# Altium schematic sheet 8V54816A_SUPPLY.SchDoc: AMC FMC Carrier v4
size 420 x 297 mm; CompanyName: WUT; Organization: WUT ISE; Address1: Warsaw University of Technology; Address2: Nowowiejska 15/19 00-665 Warsaw; Address3: t.przywozki@gmail.com; Revision: 1; SheetNumber: 24; SheetTotal: 29; Project: AMC FMC Carrier v4.0.2; ModifiedBy: F. Świtakowski; CheckedDate: -; Title2: 8V54816A Supply; DivGrp: ISE; Designer: T. Przywozki; ModifiedDate: -; ProjectName: ADC/DAC MEZZANINE
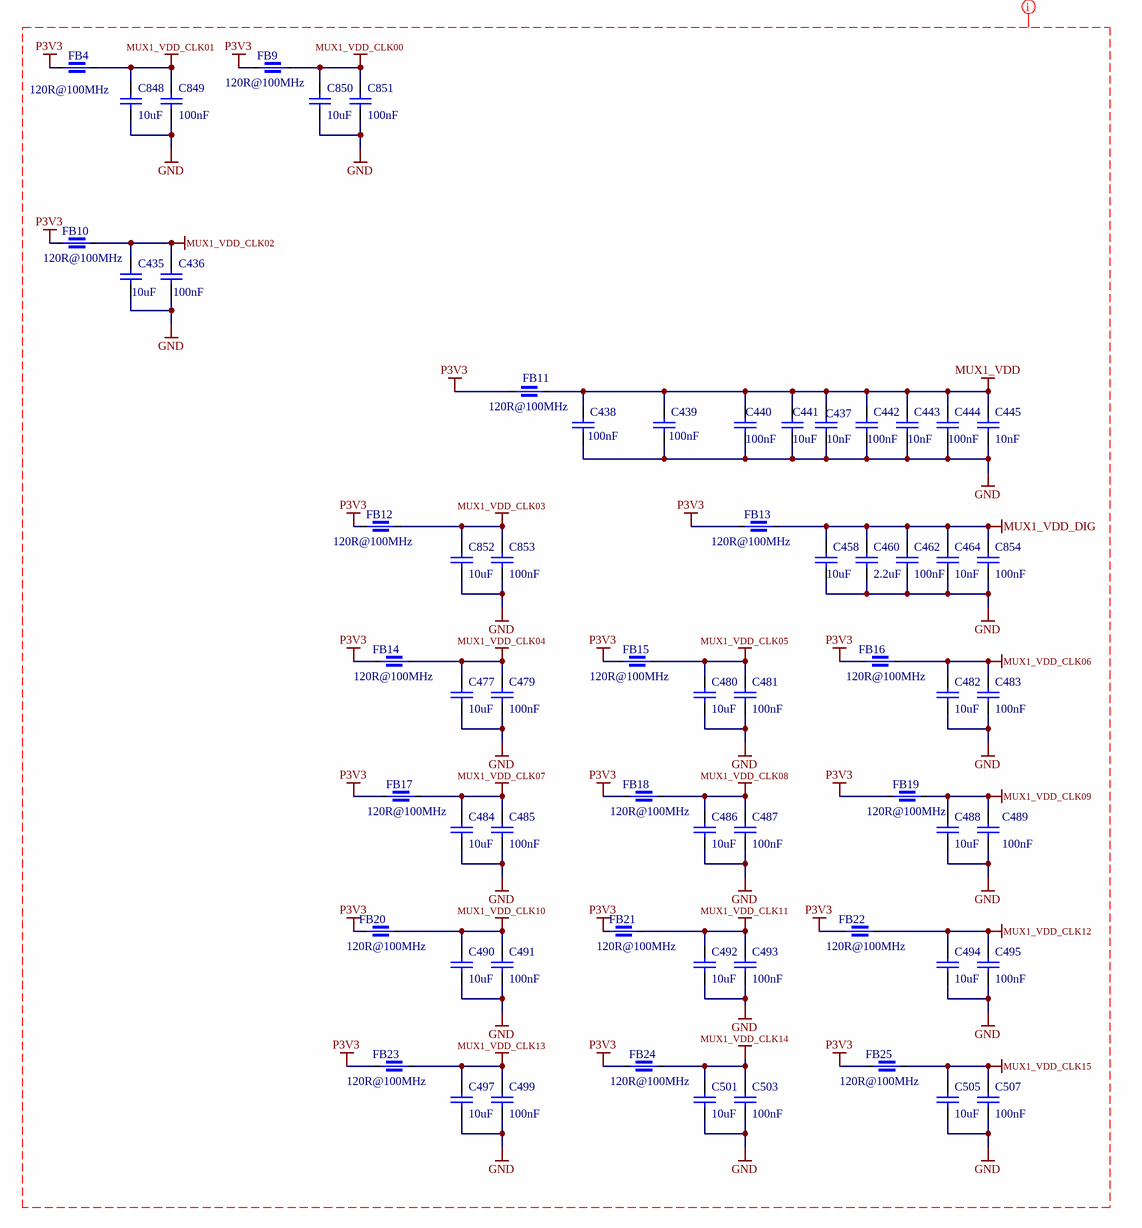
[diagram p0: 8V54816A_SUPPLY.SchDoc]

## Parts
C435  10uF  [CAPC1608X87N]
C436  100nF  [CAPC0603X33N]
C437  10nF  [CAPC0603X33N]
C438  100nF  [CAPC0603X33N]
C439  100nF  [CAPC0603X33N]
C440  100nF  [CAPC0603X33N]
C441  10uF  [CAPC1608X87N]
C442  100nF  [CAPC0603X33N]
C443  10nF  [CAPC0603X33N]
C444  100nF  [CAPC0603X33N]
C445  10nF  [CAPC0603X33N]
C458  10uF  [CAPC1608X87N]
C460  2.2uF  [CAPC1005X55N]
C462  100nF  [CAPC0603X33N]
C464  10nF  [CAPC0603X33N]
C477  10uF  [CAPC1608X87N]
C479  100nF  [CAPC0603X33N]
C480  10uF  [CAPC1608X87N]
C481  100nF  [CAPC0603X33N]
C482  10uF  [CAPC1608X87N]
C483  100nF  [CAPC0603X33N]
C484  10uF  [CAPC1608X87N]
C485  100nF  [CAPC0603X33N]
C486  10uF  [CAPC1608X87N]
C487  100nF  [CAPC0603X33N]
C488  10uF  [CAPC1608X87N]
C489  100nF  [CAPC0603X33N]
C490  10uF  [CAPC1608X87N]
C491  100nF  [CAPC0603X33N]
C492  10uF  [CAPC1608X87N]
C493  100nF  [CAPC0603X33N]
C494  10uF  [CAPC1608X87N]
C495  100nF  [CAPC0603X33N]
C497  10uF  [CAPC1608X87N]
C499  100nF  [CAPC0603X33N]
C501  10uF  [CAPC1608X87N]
C503  100nF  [CAPC0603X33N]
C505  10uF  [CAPC1608X87N]
C507  100nF  [CAPC0603X33N]
C848  10uF  [CAPC1608X87N]
C849  100nF  [CAPC0603X33N]
C850  10uF  [CAPC1608X87N]
C851  100nF  [CAPC0603X33N]
C852  10uF  [CAPC1608X87N]
C853  100nF  [CAPC0603X33N]
C854  100nF  [CAPC0603X33N]
FB4  120R@100MHz  [INDC1005X55N]
FB9  120R@100MHz  [INDC1005X55N]
FB10  120R@100MHz  [INDC1005X55N]
FB11  120R@100MHz  [INDC1005X55N]
FB12  120R@100MHz  [INDC1005X55N]
FB13  120R@100MHz  [INDC1005X55N]
FB14  120R@100MHz  [INDC1005X55N]
FB15  120R@100MHz  [INDC1005X55N]
FB16  120R@100MHz  [INDC1005X55N]
FB17  120R@100MHz  [INDC1005X55N]
FB18  120R@100MHz  [INDC1005X55N]
FB19  120R@100MHz  [INDC1005X55N]
FB20  120R@100MHz  [INDC1005X55N]
FB21  120R@100MHz  [INDC1005X55N]
FB22  120R@100MHz  [INDC1005X55N]
FB23  120R@100MHz  [INDC1005X55N]
FB24  120R@100MHz  [INDC1005X55N]
FB25  120R@100MHz  [INDC1005X55N]

## Nets
GND: C435.1 C436.1 C437.1 C438.1 C439.1 C440.1 C441.1 C442.1 C443.1 C444.1 C445.1 C458.1 C460.1 C462.1 C464.1 C477.1 C479.1 C480.1 C481.1 C482.1 C483.1 C484.1 C485.1 C486.1 C487.1 C488.1 C489.1 C490.1 C491.1 C492.1 C493.1 C494.1 C495.1 C497.1 C499.1 C501.1 C503.1 C505.1 C507.1 C848.1 C849.1 C850.1 C851.1 C852.1 C853.1 C854.1
MUX1_VDD: C437.2 C438.2 C439.2 C440.2 C441.2 C442.2 C443.2 C444.2 C445.2 FB11.1
MUX1_VDD_CLK00: C850.2 C851.2 FB9.1
MUX1_VDD_CLK01: C848.2 C849.2 FB4.1
MUX1_VDD_CLK02: C435.2 C436.2 FB10.1
MUX1_VDD_CLK03: C852.2 C853.2 FB12.1
MUX1_VDD_CLK04: C477.2 C479.2 FB14.1
MUX1_VDD_CLK05: C480.2 C481.2 FB15.1
MUX1_VDD_CLK06: C482.2 C483.2 FB16.1
MUX1_VDD_CLK07: C484.2 C485.2 FB17.1
MUX1_VDD_CLK08: C486.2 C487.2 FB18.1
MUX1_VDD_CLK09: C488.2 C489.2 FB19.1
MUX1_VDD_CLK10: C490.2 C491.2 FB20.1
MUX1_VDD_CLK11: C492.2 C493.2 FB21.1
MUX1_VDD_CLK12: C494.2 C495.2 FB22.1
MUX1_VDD_CLK13: C497.2 C499.2 FB23.1
MUX1_VDD_CLK14: C501.2 C503.2 FB24.1
MUX1_VDD_CLK15: C505.2 C507.2 FB25.1
MUX1_VDD_DIG: C458.2 C460.2 C462.2 C464.2 C854.2 FB13.1
P3V3: FB4.2 FB9.2 FB10.2 FB11.2 FB12.2 FB13.2 FB14.2 FB15.2 FB16.2 FB17.2 FB18.2 FB19.2 FB20.2 FB21.2 FB22.2 FB23.2 FB24.2 FB25.2

## Layout directives
net class POWER: GND, MUX1_VDD, MUX1_VDD_CLK00, MUX1_VDD_CLK01, MUX1_VDD_CLK02, MUX1_VDD_CLK03, MUX1_VDD_CLK04, MUX1_VDD_CLK05, MUX1_VDD_CLK06, MUX1_VDD_CLK07, MUX1_VDD_CLK08, MUX1_VDD_CLK09, MUX1_VDD_CLK10, MUX1_VDD_CLK11, MUX1_VDD_CLK12, MUX1_VDD_CLK13, MUX1_VDD_CLK14, MUX1_VDD_CLK15, MUX1_VDD_DIG, P3V3

## Notes on the sheet
- Project/Equipment
- Document
- Designer
- Drawn by
- Check.by
- Copyright CNPEM 2013, WUT ISE 2020
  This documentation describes Open Hardware and is licensed under CERN OHL v.1.1. You may redistribute and modify this documentaction under the terms of the CERN OHL v1.1.
  (http://ohwr.org/CERNOHL). This documentation is dristributed WITHOUT ANY EXPRESS OR IMPLIED WARRANTY, INCLUDING OF MERCHANTABLITY, SATISFACTORY QUALITY AND FITNESS FOR A PARTICULAR PURPOSE. Please see the CERN OHL v.1.1 for applicable conditions
- File
- Last Mod.
- Print Date
- Sheet
- Size
- A3
- of
- Rev
- Contact:

## Library data of the parts
C435 C441 C458 C477 C480 C482 C484 C486 C488 C490 C492 C494 C497 C501 C505 C848 C850 C852 = CC0603_10uF_6.3V_20%_X5R: Non-polarised capacitor; Manufacturer: GENERIC; Part Description: SMD Multilayer Chip Ceramic Capacitor; Manufacturer1 Part Number: C0603C106M9PAC; Tolerance: ±20%; Voltage: 6.3V; TC: X5R; Manufacturer Part Number: CC0603_10uF_6.3V_20%_X5R; Part Number: CC0603_10UF_6.3V_20%_X5R; Value: 10uF; Component Kind: Standard; Component Type: Standard; Pin Count: 2; Status: Preferred; Case: 0603; Mounted: Yes; Socket: No; SMD: Yes; Sense: No; Manufacturer1 Example: KEMET; Manufacturer1 ComponentHeight: 0.95mm; HelpURL: \\cern.ch\dfs\Applications\Altium\Datasheets\CC0603_X5R_KEMET.pdf; Author: CERN DEM JLC; CreateDate: 03/12/2007; LatestRevisionDate: 03/12/2007
C436 C438-C440 C442 C444 C462 C479 C481 C483 C485 C487 C489 C491 C493 C495 C499 C503 C507 C849 C851 C853 C854 = CC0201_100NF_6.3V_10%_X5R: Non-polarised capacitor; Manufacturer: GENERIC; Part Description: SMD Multilayer Chip Ceramic Capacitor; Manufacturer1 Part Number: 02016D104KAT2A; Tolerance: ±10%; Voltage: 6.3V; TC: X5R; Manufacturer Part Number: CC0201_100NF_6.3V_10%_X5R; Part Number: CC0201_100NF_6.3V_10%_X5R; Value: 100nF; Component Kind: Standard; Component Type: Standard; Pin Count: 2; Status: Not Recommended; Case: 0201; Mounted: Yes; Socket: No; SMD: Yes; Sense: No; Manufacturer1 Example: AVX; Manufacturer1 ComponentHeight: 0.33mm; HelpURL: \\cern.ch\dfs\Applications\Altium\Datasheets\CC0201_X5R_AVX.pdf; Author: CERN DEM JLC; CreateDate: 03/12/2007; LatestRevisionDate: 03/12/2007
C437 C443 C445 C464 = CC0201_10NF_10V_10%_X5R: Non-polarised capacitor; Manufacturer: GENERIC; Manufacturer1 Part Number: 0201ZD103KAT2A; Part Description: SMD Multilayer Chip Ceramic Capacitor; TC: X5R; Tolerance: ±10%; Voltage: 10V; Author: CERN DEM JLC; Case: 0201; Component Kind: Standard; Component Type: Standard; CreateDate: 03/12/2007; HelpURL: \\cern.ch\dfs\Applications\Altium\Datasheets\CC0201_X5R_AVX.pdf; LatestRevisionDate: 03/12/2007; Manufacturer Part Number: CC0201_10NF_10V_10%_X5R; Manufacturer1 ComponentHeight: 0.33mm; Manufacturer1 Example: AVX; Mounted: Yes; Part Number: CC0201_10NF_10V_10%_X5R; Pin Count: 2; SMD: Yes; Socket: No; Status: Not Recommended; Value: 10nF; Sense: No
C460 = CC0402_2.2UF_6.3V_10%_X5R: Non-polarised capacitor; Manufacturer: GENERIC; Part Description: SMD Multilayer Chip Ceramic Capacitor; Manufacturer1 Part Number: C1005X5R0J225K050BC; Tolerance: ±10%; Voltage: 6.3V; TC: X5R; Manufacturer Part Number: CC0402_2.2UF_6.3V_10%_X5R; Part Number: CC0402_2.2UF_6.3V_10%_X5R; Value: 2.2uF; Component Kind: Standard; Component Type: Standard; Pin Count: 2; Status: Preferred; Case: 0402; Mounted: Yes; Socket: No; SMD: Yes; Sense: No; Manufacturer1 Example: TDK; Manufacturer1 ComponentHeight: 0.55mm; HelpURL: \\cern.ch\dfs\Applications\Altium\Datasheets\CC0402_X5R_TDK_C.pdf; Author: CERN DEM JMW; CreateDate: 22/09/2015; LatestRevisionDate: 22/09/2015
FB4 FB9-FB25 = IND0402_MURATA_BLM15PX121SN1D: Manufacturer: MURATA; Part Description: SMD EMIFIL Chip Ferrite Bead; Power: 2A; Resistance: 0.055R; Tolerance: ±25%; Author: CERN DEM JMW; Case: 0402; Component Kind: Standard; Component Type: Standard; ComponentHeight: 0.55mm; CreateDate: 19/02/2014; HelpURL: \\cern.ch\dfs\Applications\Altium\Datasheets\IND0402_MURATA_BLM15PX.pdf; LatestRevisionDate: 25/10/2018; Manufacturer Part Number: BLM15PX121SN1D; Mounted: Yes; Part Number: IND0402_MURATA_BLM15PX121SN1D; Pin Count: 2; SMD: Yes; Socket: No; Status: None; Value: 120R@100MHz; Sense: No